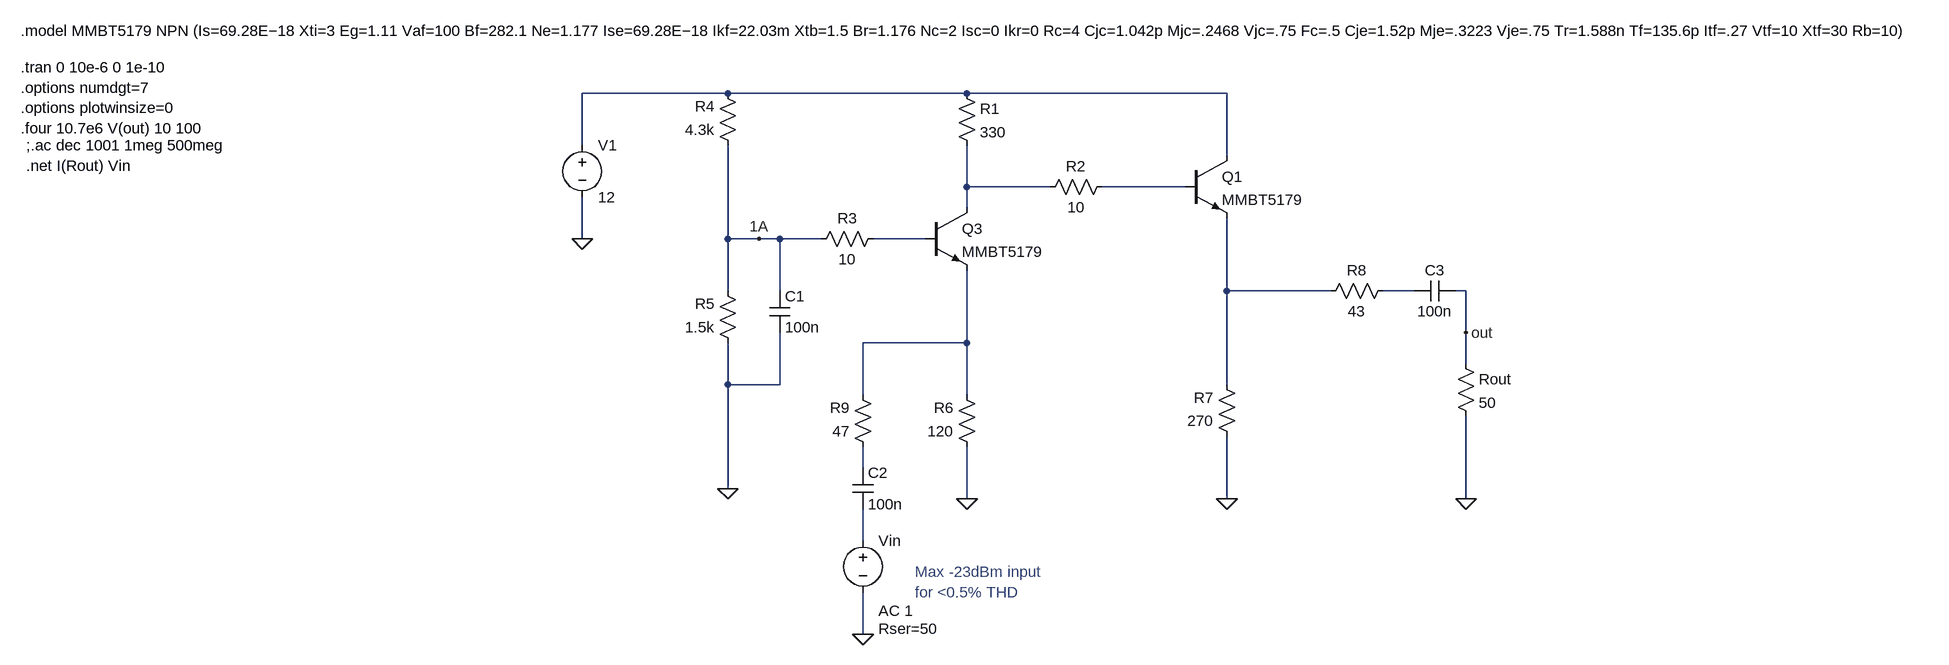
[diagram p0: schematic TIA.asc]
TIA.asc, the LTspice schematic file:
Version 4
SHEET 1 3536 2356
WIRE 336 -448 112 -448
WIRE 704 -448 336 -448
WIRE 1104 -448 704 -448
WIRE 112 -368 112 -448
WIRE 1104 -352 1104 -448
WIRE 704 -304 704 -368
WIRE 832 -304 704 -304
WIRE 1040 -304 912 -304
WIRE 704 -272 704 -304
WIRE 112 -224 112 -288
WIRE 336 -224 336 -368
WIRE 384 -224 336 -224
WIRE 416 -224 384 -224
WIRE 480 -224 416 -224
WIRE 640 -224 560 -224
WIRE 336 -144 336 -224
WIRE 416 -144 416 -224
WIRE 1104 -144 1104 -256
WIRE 1264 -144 1104 -144
WIRE 1392 -144 1344 -144
WIRE 1472 -144 1456 -144
WIRE 1472 -80 1472 -144
WIRE 704 -64 704 -176
WIRE 704 -64 544 -64
WIRE 1472 -32 1472 -80
WIRE 336 0 336 -64
WIRE 416 0 416 -80
WIRE 416 0 336 0
WIRE 1104 0 1104 -144
WIRE 544 16 544 -64
WIRE 704 16 704 -64
WIRE 544 128 544 96
WIRE 336 160 336 0
WIRE 704 176 704 96
WIRE 1104 176 1104 80
WIRE 1472 176 1472 48
WIRE 544 240 544 192
WIRE 544 384 544 320
FLAG 112 -224 0
FLAG 336 160 0
FLAG 704 176 0
FLAG 1104 176 0
FLAG 1472 176 0
FLAG 544 384 0
FLAG 384 -224 1A
FLAG 1472 -80 out
SYMBOL npn 640 -272 R0
SYMATTR InstName Q3
SYMATTR Value MMBT5179
SYMBOL npn 1040 -352 R0
SYMATTR InstName Q1
SYMATTR Value MMBT5179
SYMBOL res 688 -464 R0
SYMATTR InstName R1
SYMATTR Value 330
SYMBOL res 928 -320 R90
WINDOW 0 0 56 VBottom 2
WINDOW 3 32 56 VTop 2
SYMATTR InstName R2
SYMATTR Value 10
SYMBOL res 576 -240 R90
WINDOW 0 0 56 VBottom 2
WINDOW 3 32 56 VTop 2
SYMATTR InstName R3
SYMATTR Value 10
SYMBOL res 352 -352 R180
WINDOW 0 36 76 Left 2
WINDOW 3 36 40 Left 2
SYMATTR InstName R4
SYMATTR Value 4.3k
SYMBOL res 352 -48 R180
WINDOW 0 36 76 Left 2
WINDOW 3 36 40 Left 2
SYMATTR InstName R5
SYMATTR Value 1.5k
SYMBOL res 720 112 R180
WINDOW 0 36 76 Left 2
WINDOW 3 36 40 Left 2
SYMATTR InstName R6
SYMATTR Value 120
SYMBOL res 1120 96 R180
WINDOW 0 36 76 Left 2
WINDOW 3 36 40 Left 2
SYMATTR InstName R7
SYMATTR Value 270
SYMBOL res 1248 -128 R270
WINDOW 0 32 56 VTop 2
WINDOW 3 0 56 VBottom 2
SYMATTR InstName R8
SYMATTR Value 43
SYMBOL voltage 112 -384 R0
WINDOW 123 0 0 Left 0
WINDOW 39 0 0 Left 0
SYMATTR InstName V1
SYMATTR Value 12
SYMBOL res 560 112 R180
WINDOW 0 36 76 Left 2
WINDOW 3 36 40 Left 2
SYMATTR InstName R9
SYMATTR Value 47
SYMBOL cap 400 -144 R0
SYMATTR InstName C1
SYMATTR Value 100n
SYMBOL cap 528 128 R0
SYMATTR InstName C2
SYMATTR Value 100n
SYMBOL cap 1456 -160 R90
WINDOW 0 0 32 VBottom 2
WINDOW 3 32 32 VTop 2
SYMATTR InstName C3
SYMATTR Value 100n
SYMBOL res 1456 -48 R0
SYMATTR InstName Rout
SYMATTR Value 50
SYMBOL voltage 544 224 R0
WINDOW 3 24 96 Invisible 2
WINDOW 123 24 124 Left 2
WINDOW 39 24 152 Left 2
SYMATTR Value SINE(0 45e-3 10.7e6)
SYMATTR Value2 AC 1
SYMATTR SpiceLine Rser=50
SYMATTR InstName Vin
TEXT -752 -544 Left 2 !.model MMBT5179 NPN (Is=69.28E−18 Xti=3 Eg=1.11 Vaf=100 Bf=282.1 Ne=1.177 Ise=69.28E−18 Ikf=22.03m Xtb=1.5 Br=1.176 Nc=2 Isc=0 Ikr=0 Rc=4 Cjc=1.042p Mjc=.2468 Vjc=.75 Fc=.5 Cje=1.52p Mje=.3223 Vje=.75 Tr=1.588n Tf=135.6p Itf=.27 Vtf=10 Xtf=30 Rb=10)
TEXT -744 -368 Left 2 !;.ac dec 1001 1meg 500meg\n.net I(Rout) Vin
TEXT -752 -488 Left 2 !.tran 0 10e-6 0 1e-10\n.options numdgt=7\n.options plotwinsize=0\n.four 10.7e6 V(out) 10 100
TEXT 624 288 Left 2 ;Max -23dBm input \nfor <0.5% THD

The netlist it stands for:
* TIA.asc
Q3 N002 N004 N007 0 MMBT5179
Q1 N001 N003 N005 0 MMBT5179
R1 N001 N002 330
R2 N003 N002 10
R3 N004 1A 10
R4 1A N001 4.3k
R5 0 1A 1.5k
R6 0 N007 120
R7 0 N005 270
R8 N005 N006 43
V1 N001 0 12
R9 N008 N007 47
C1 1A 0 100n
C2 N008 N009 100n
C3 out N006 100n
Rout out 0 50
Vin N009 0 SINE(0 45e-3 10.7e6) AC 1 Rser=50
.model NPN NPN
.model PNP PNP
.lib standard.bjt
.model MMBT5179 NPN (Is=69.28E−18 Xti=3 Eg=1.11 Vaf=100 Bf=282.1 Ne=1.177 Ise=69.28E−18 Ikf=22.03m Xtb=1.5 Br=1.176 Nc=2 Isc=0 Ikr=0 Rc=4 Cjc=1.042p Mjc=.2468 Vjc=.75 Fc=.5 Cje=1.52p Mje=.3223 Vje=.75 Tr=1.588n Tf=135.6p Itf=.27 Vtf=10 Xtf=30 Rb=10)
;.ac dec 1001 1meg 500meg
.net I(Rout) Vin
.tran 0 10e-6 0 1e-10
.options numdgt=7
.options plotwinsize=0
.four 10.7e6 V(out) 10 100
* Max -23dBm input
* for <0.5% THD
.backanno
.end